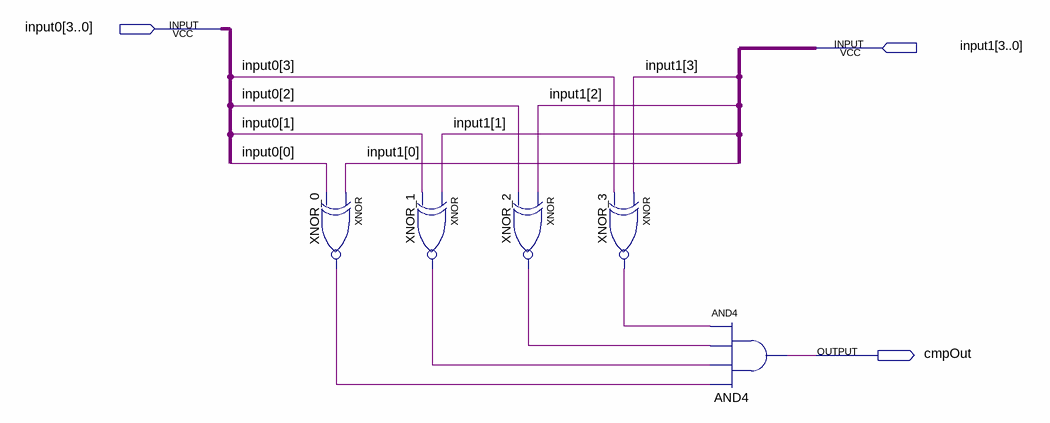
[diagram p0: schematic sheet]
// Quartus schematic EqCmp4.bdf as structural Verilog: 5 symbols, 3 pins
module EqCmp4 (
  input  [3:0] input0,
  input  [3:0] input1,
  output cmpOut
);

  wire XNOR_0_out, XNOR_1_out, XNOR_2_out, XNOR_3_out;

  xnor XNOR_0 (XNOR_0_out, input1[0], input0[0]);
  xnor XNOR_1 (XNOR_1_out, input1[1], input0[1]);
  xnor XNOR_2 (XNOR_2_out, input1[2], input0[2]);
  xnor XNOR_3 (XNOR_3_out, input1[3], input0[3]);
  and AND4 (cmpOut, XNOR_3_out, XNOR_2_out, XNOR_1_out, XNOR_0_out);
endmodule
